# EAGLE design OneBellInterfaceRevA (EAGLE 7.2.0)
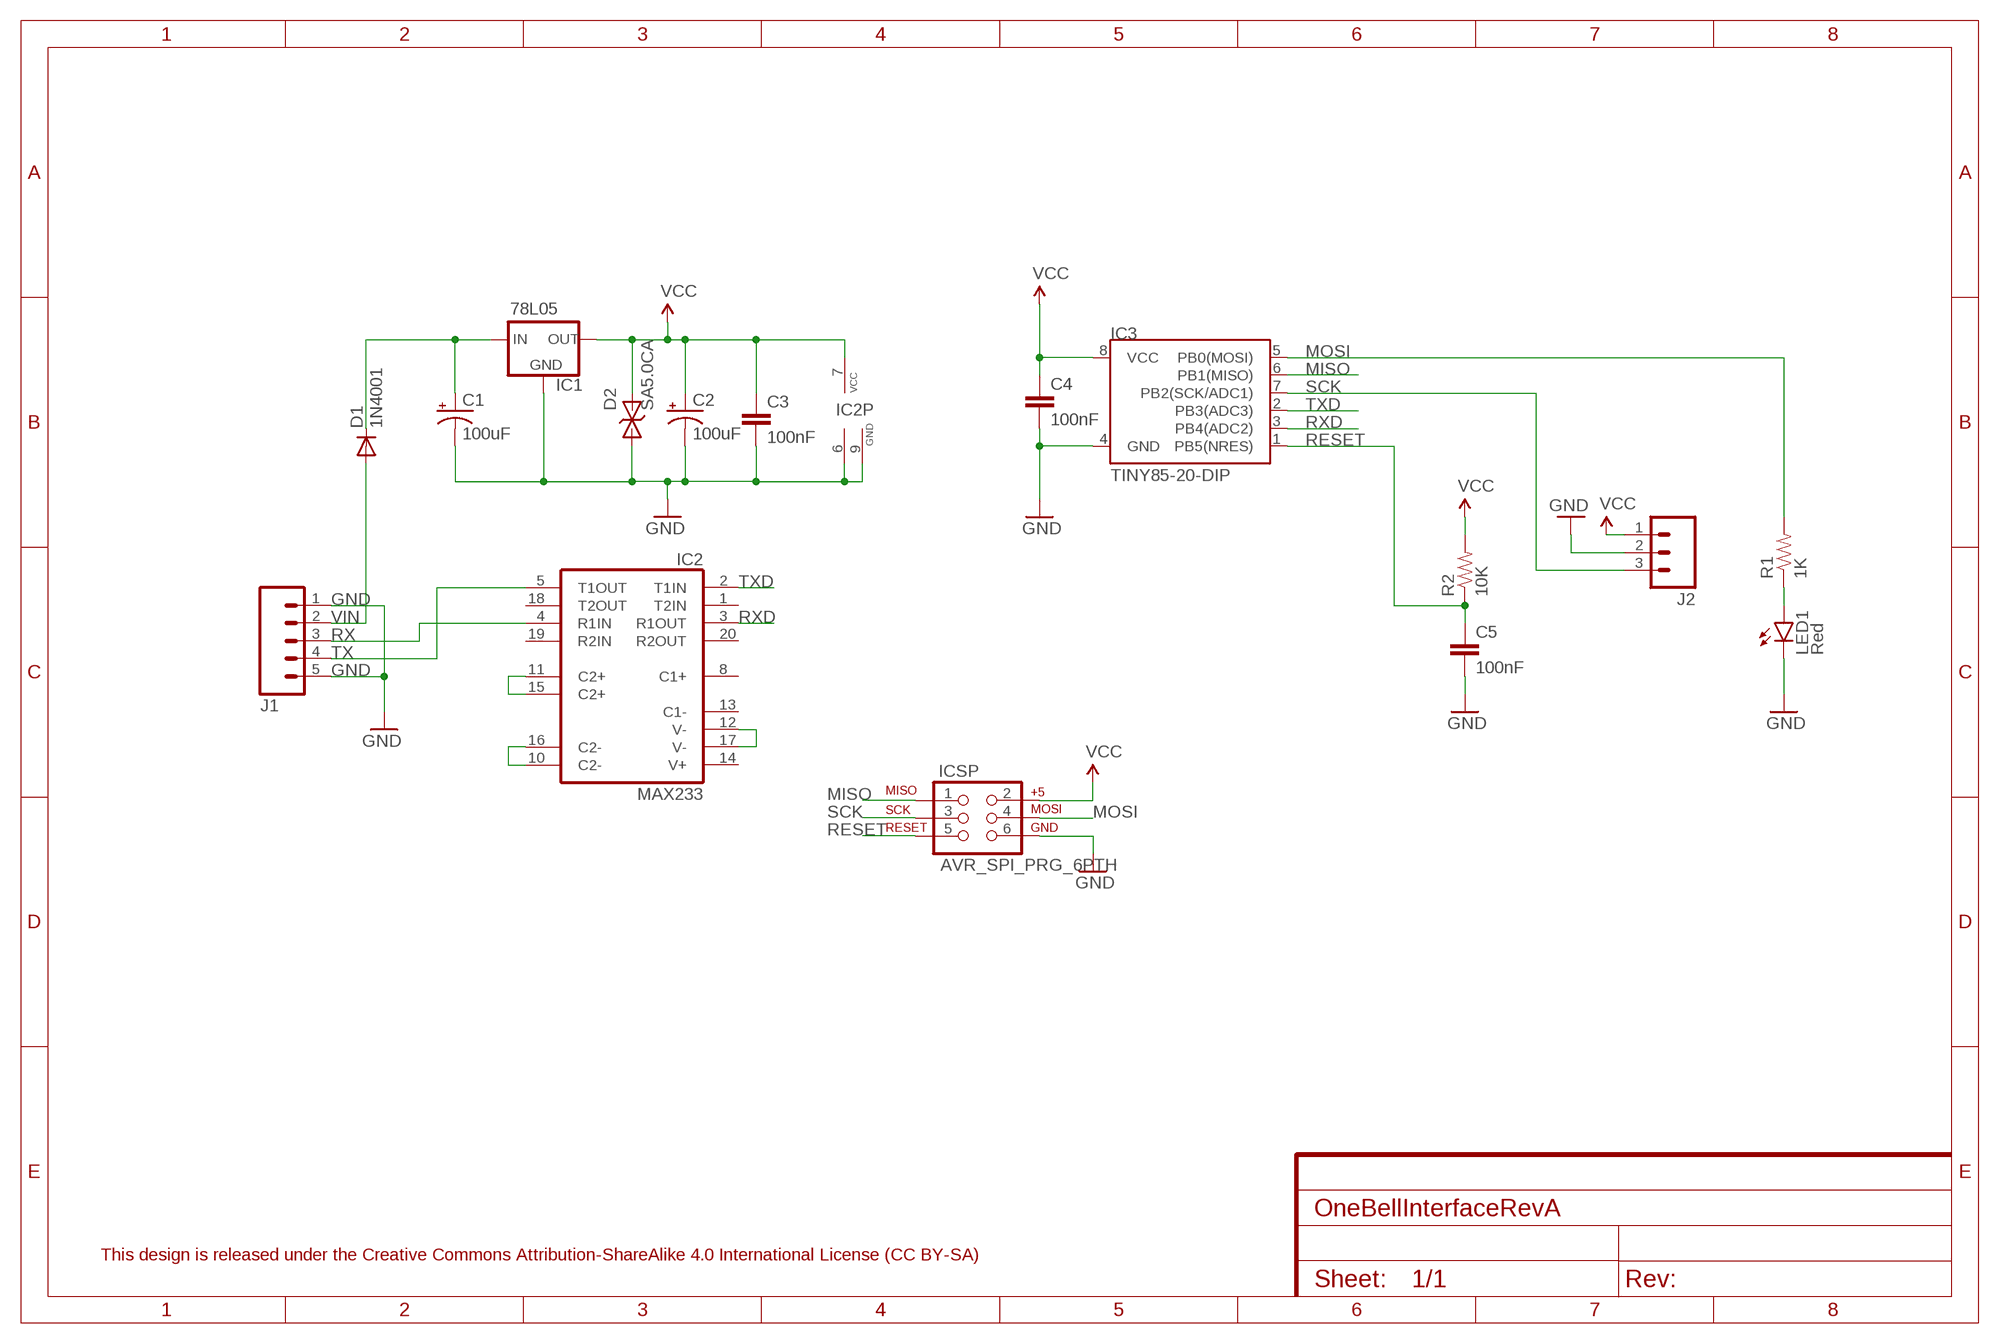
[diagram p0: schematic, sheet 1]
FRAME1 (FRAME-A4L): CNAME: One Bell Simulator Interface; CREVISION: A 05/2015; DESIGNER: Andrew Instone-Cowie

## Parts
C1  100uF  CAP_POLPTH1  [CPOL-RADIAL-100UF-25V]
C2  100uF  CAP_POLPTH1  [CPOL-RADIAL-100UF-25V]
C3  100nF  CAPPTH  [CAP-PTH-SMALL]
C4  100nF  CAPPTH  [CAP-PTH-SMALL]
C5  100nF  CAPPTH  [CAP-PTH-SMALL]
D1  1N4001  [DO41_DIODE]
D2  SA5.0CA  [DO41_TVS]
IC1  78L05  V_REG_78XXTO-92_UNTESTED  [TO-92]
IC2  MAX233  [DIL20]
IC3  TINY85-20-DIP  ATTINY45DIL08_LONG_PADS  [DIL08]
ICSP  AVR_SPI_PRG_6PTH  [2X3]
J1  M05PTH  [1X05]
J2  M03PTH  [1X03]
LED1  Red  LED3MM  [LED3MM]
R1  1K  RESISTORPTH-1/4W  [AXIAL-0.4]
R2  10K  RESISTORPTH-1/4W  [AXIAL-0.4]

## Nets
GND: C1.2(-) C2.2(-) C3.2 C4.2 C5.2 D2.A IC1.2(GND) IC2.6(GND) IC2.9(GND) IC3.4(GND) ICSP.6 J1.1 J1.5 J2.2 LED1.K(C)
MISO: IC3.6(PB1(MISO)) ICSP.1
MOSI: IC3.5(PB0(MOSI)) ICSP.4 R1.P$2
N$1: C1.1(+) D1.C IC1.3(IN)
N$6: LED1.A R1.P$1
N$10: IC2.11(C2+) IC2.15(C2+)
N$11: IC2.10(C2-) IC2.16(C2-)
N$12: IC2.12(V-) IC2.17(V-)
RESET: C5.1 IC3.1(PB5(NRES)) ICSP.5 R2.P$1
RX: IC2.4(R1IN) J1.3
RXD: IC2.3(R1OUT) IC3.3(PB4(ADC2))
SCK: IC3.7(PB2(SCK/ADC1)) ICSP.3 J2.3
TX: IC2.5(T1OUT) J1.4
TXD: IC2.2(T1IN) IC3.2(PB3(ADC3))
VCC: C2.1(+) C3.1 C4.1 D2.C IC1.1(OUT) IC2.7(VCC) IC3.8(VCC) ICSP.2 J2.1 R2.P$2
VIN: D1.A J1.2
Unconnected: IC2.1(T2IN) IC2.8(C1+) IC2.13(C1-) IC2.14(V+) IC2.18(T2OUT) IC2.19(R2IN) IC2.20(R2OUT)

## Notes on the sheet
- This design is released under the Creative Commons Attribution-ShareAlike 4.0 International License (CC BY-SA)

## Library data of the parts
C1 C2 = SparkFun-Passives:CAP_POL: Capacitor Polarized These are standard SMD and PTH capacitors. Normally 10uF, 47uF, and 100uF in electrolytic and tantalum varieties. Always verify the external diameter of the through hole cap, it varies with capacity, voltage, and manufacturer. The EIA devices should be standard.
C3-C5 = SparkFun-Passives:CAP: Capacitor Standard 0603 ceramic capacitor, and 0.1" leaded capacitor.
D1 = AIC_Custom:1N4001: DIODE general purpose rectifier, 1 A
D2 = AIC_Custom:SA5.0CA: SA5.0CA TVS Bi-Directional Transient Voltage Suppressor. 5V, DO41 package
IC1 = SparkFun-PowerIC:V_REG_78XX: Voltage Regulator Standard 78xx regulator. IGO (Input Ground Output). Spark Fun Electronics SKU : COM-00107
IC2 = maxim:MAX233: RS232 TRANSCEIVER; MPN: MAX233ACPP+G36; OC_FARNELL: 1593332; OC_NEWARK: 89K3459
IC3 = AIC_Custom:ATTINY45: Atmel 8-pin 2/4/8kB flash uC
ICSP = SparkFun-Connectors:AVR_SPI_PRG_6: AVR ISP 6 Pin This is the reduced ISP connector for AVR programming. Common on Arduino. This footprint will take up less PCB space and can be used with a 10-pin to 6-pin adapter such as SKU: BOB-08508 **Special note about "TEST_POINT" package. The stop mask is on the top side, so if you want your programming test points to be on the bottom of your board, make sure to place this package on the bottom side of the board. This also ensure that the orientation to program from the bottom side will be correct.
J1 = SparkFun-Connectors:M05: Header 5 Standard 5-pin 0.1" header. Use with straight break away headers (SKU : PRT-00116), right angle break away headers (PRT-00553), swiss pins (PRT-00743), machine pins (PRT-00117), and female headers (PRT-00115). Molex polarized connector foot print use with SKU : PRT-08230 with associated crimp pins and housings.
J2 = SparkFun-Connectors:M03: Header 3 Standard 3-pin 0.1" header. Use with straight break away headers (SKU : PRT-00116), right angle break away headers (PRT-00553), swiss pins (PRT-00743), machine pins (PRT-00117), and female headers (PRT-00115). Molex polarized connector foot print use with SKU : PRT-08232 with associated crimp pins and housings.
LED1 = SparkFun-LED:LED: LEDs Standard schematic elements and footprints for 5mm, 3mm, 1206, and 0603 sized LEDs. 5mm - Spark Fun Electronics SKU : COM-00529 (and others)
R1 R2 = SparkFun-Passives:RESISTOR: Resistor Basic schematic elements and footprints for 0603, 1206, and PTH resistors.

## Board
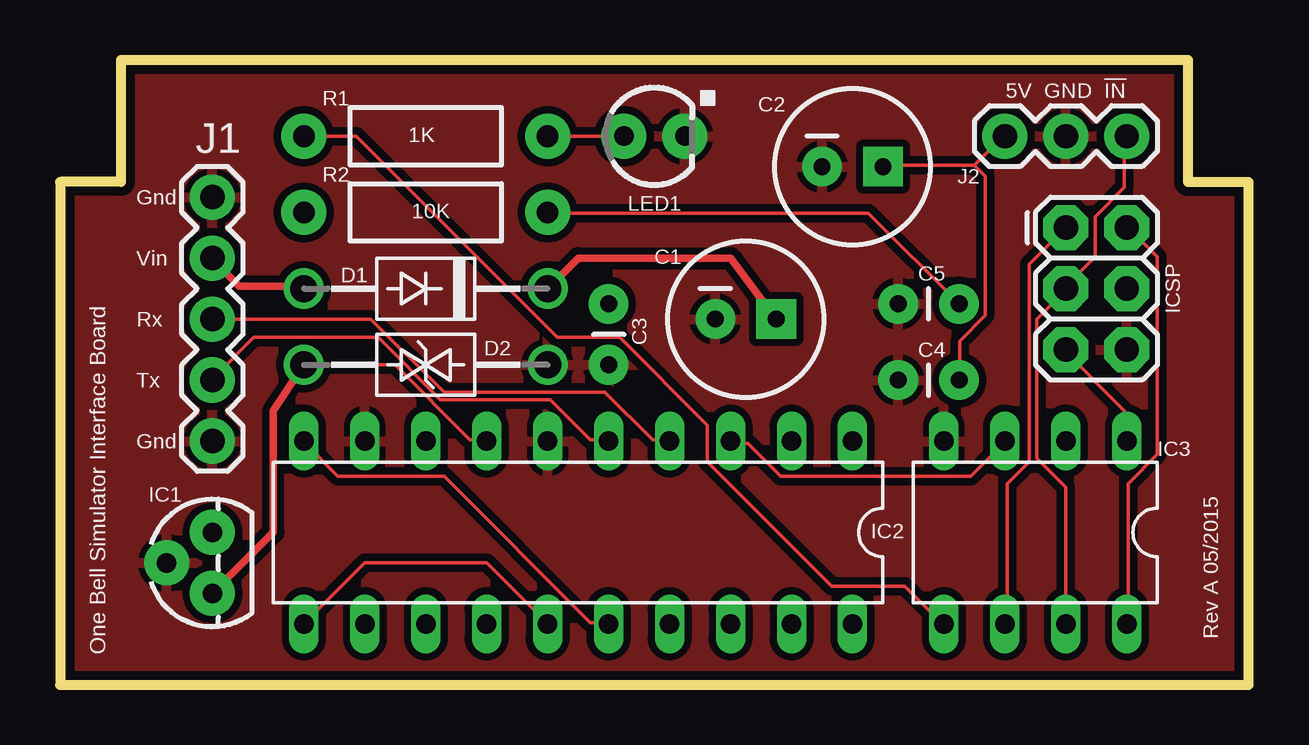
[diagram p1: board, top side]
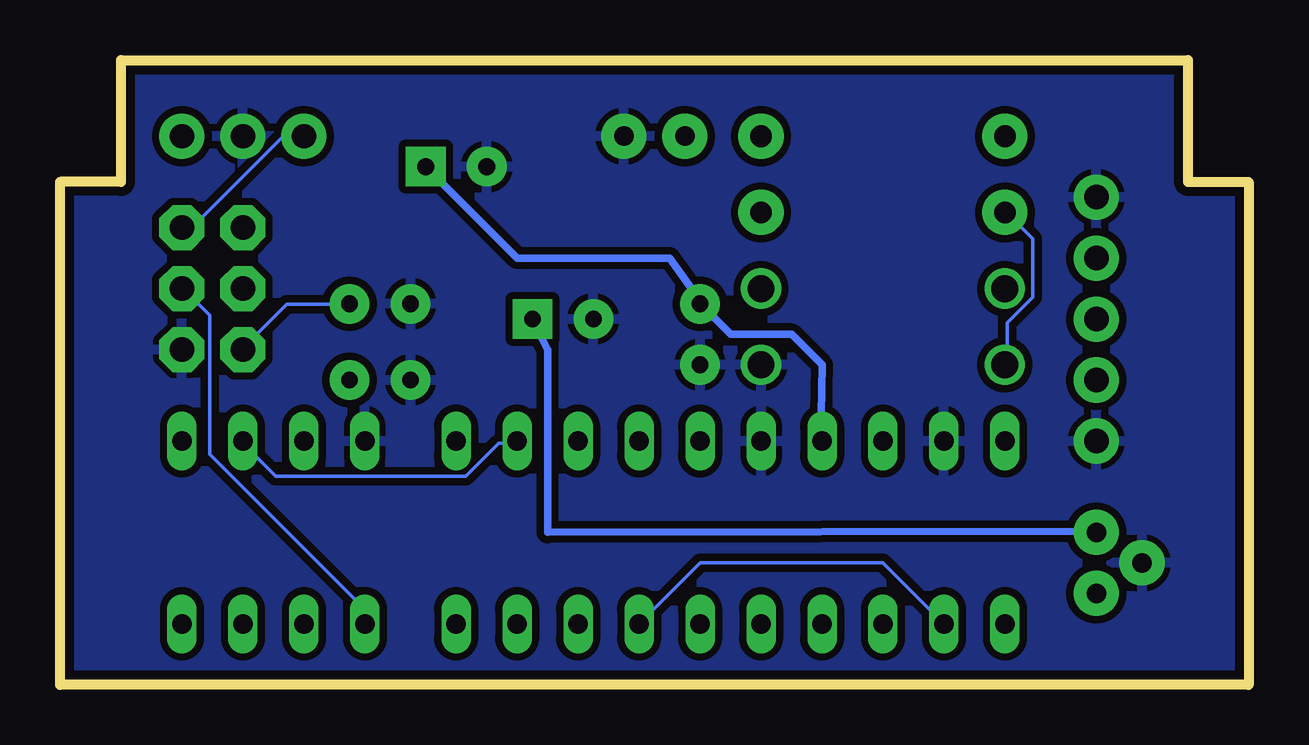
[diagram p2: board, bottom side, seen from below]

Size 49.53 x 26.04 mm. Coordinates in mm from the lower left corner, seen from the top.
Outline: 0,0 49.53,0 49.53,20.95 46.99,20.95 46.99,26.04 2.54,26.04 2.54,20.95 0,20.95 0,0
Copper layers (1*16): Top 0.0356mm / dielectric 1.5011mm / Bottom 0.0356mm
Design rules "LaenPCBOrder(OSHPARK)": minimum track width 6mil, minimum drill 13mil, track to track 6mil, track to pad 6mil, pad to pad 6mil, via to via 6mil, smd to smd 6mil, copper to edge 15mil, drill to drill 6mil, minimum pad ring 7mil, minimum via ring 7mil, stop-mask expansion 3mil, vias tented up to drill 0mil, thermal gap 10mil

### Footprints (pad centres in the part's own frame; a part is rotated, then mirrored left to right if it is on the bottom)
CPOL-RADIAL-100UF-25V = drill 0.7 pad 1.651 square: 1 1.27,0 | drill 0.7 pad 1.651: 2 -1.27,0
CAP-PTH-SMALL = drill 0.7 pad 1.651: 1 0,0; 2 2.54,0
DO41_DIODE = drill 1.118: A 5.08,0; C -5.08,0
DO41_TVS = drill 1.118: A 5.08,0; C -5.08,0
TO-92 = drill 0.813 pad 1.88: 1 -1.27,0; 2 0,1.905; 3 1.27,0
DIL20 = drill 0.813 long: 1 -11.43,-3.81; 2 -8.89,-3.81; 3 -6.35,-3.81; 4 -3.81,-3.81; 5 -1.27,-3.81; 6 1.27,-3.81; 7 3.81,-3.81; 8 6.35,-3.81; 9 8.89,-3.81; 10 11.43,-3.81; 11 11.43,3.81; 12 8.89,3.81; 13 6.35,3.81; 14 3.81,3.81; 15 1.27,3.81; 16 -1.27,3.81; 17 -3.81,3.81; 18 -6.35,3.81; 19 -8.89,3.81; 20 -11.43,3.81
DIL08 = drill 0.813 long: 1 -3.81,-3.81; 2 -1.27,-3.81; 3 1.27,-3.81; 4 3.81,-3.81; 5 3.81,3.81; 6 1.27,3.81; 7 -1.27,3.81; 8 -3.81,3.81
2X3 = drill 1.016 pad 1.88 octagon: 1 0,0; 2 0,2.54; 3 2.54,0; 4 2.54,2.54; 5 5.08,0; 6 5.08,2.54
1X05 = drill 1.016 pad 1.88: 1 0,0; 2 2.54,0; 3 5.08,0; 4 7.62,0; 5 10.16,0
1X03 = drill 1.016 pad 1.88: 1 0,0; 2 2.54,0; 3 5.08,0
LED3MM = drill 0.813 pad 1.88: A -1.27,0; K 1.27,0
AXIAL-0.4 = drill 0.9 pad 1.88: P$1 -5.08,0; P$2 5.08,0

### Placement (x,y rotation side)
C1  28.57,15.24 0 top
C2  33.02,21.59 0 top
C3  22.86,15.88 270 top
C4  37.47,12.7 180 top
C5  37.47,15.88 180 top
D1  15.24,16.51 180 top
D2  15.24,13.34 0 top
IC1  6.35,5.08 90 top
IC2  21.59,6.35 180 top
IC3  40.64,6.35 180 top
ICSP  41.91,19.05 270 top
J1  6.35,20.32 270 top
J2  39.37,22.86 0 top
LED1  24.77,22.86 0 top
R1  15.24,22.86 180 top
R2  15.24,19.68 180 top

### Tracks (layer width: path | path; a pad name or v marks a point on that pad's centre or on a via)
GND
  pour Bottom (isolate 0.305): 2.54,26.04 2.54,20.95 0,20.95 0,0 49.53,0 49.53,20.95 46.99,20.95 46.99,26.04
  pour Top (isolate 0.305): 2.54,26.04 2.54,20.95 0,20.95 0,0 49.53,0 49.53,20.95 46.99,20.95 46.99,26.04
MISO
  Top 0.152: ICSP.1 40.39,17.53 40.39,9.3 39.47,8.38 39.47,2.59 IC3.6
MOSI
  Top 0.152: R1.P$2 12.34,22.86 20.73,14.48 23.32,14.48 26.98,10.82 26.98,9.3 32.16,4.12 35.2,4.12 36.73,2.59 IC3.5
  Bottom 0.152: IC3.5 36.88,2.59 36.88,3.2 43.28,9.6 43.28,15.39 44.35,16.46 ICSP.4
N$1
  Top 0.305: D1.C 21.59,17.78 27.94,17.78 C1.1
  Bottom 0.152: 6.4,6.4 IC1.3
  Bottom 0.305: 6.4,6.4 29.21,6.35 29.21,13.97 C1.1
N$6
  Top 0.152: LED1.A R1.P$1
N$10
  Top 0.152: IC2.11 12.7,5.08 17.78,5.08 IC2.15
N$11
  Top 0.152: IC2.16 22.86,2.59 22.1,2.59 16,8.69 11.58,8.69 10.21,10.06 IC2.10
N$12
  Bottom 0.152: IC2.12 15.24,5.08 22.86,5.08 IC2.17
RESET
  Top 0.152: IC3.1 44.35,10.21 44.35,11.43 41.91,13.87 ICSP.5 | C5.1 33.68,19.66 20.42,19.66 R2.P$1
  Bottom 0.152: C5.1 37.49,15.85 40.08,15.85 41.91,14.02 ICSP.5
RX
  Top 0.152: J1.3 12.95,15.24 16,12.19 22.71,12.19 24.69,10.21 25.3,10.21 IC2.4
RXD
  Top 0.152: IC2.3 28.04,10.06 28.65,10.06 30.02,8.69 37.95,8.69 39.32,10.06 IC3.3
SCK
  Top 0.152: IC3.7 41.91,8.23 40.69,9.45 40.69,15.24 41.91,16.46 ICSP.3 41.91,16.61 43.13,17.83 43.13,19.51 44.35,20.73 44.35,22.86 J2.3
TX
  Top 0.152: IC2.5 22.86,10.21 22.1,10.21 20.42,11.89 15.85,11.89 13.26,14.48 8.08,14.48 6.4,12.8 J1.4
TXD
  Bottom 0.152: IC2.2 30.48,10.06 31.24,10.06 32.61,8.69 40.54,8.69 41.91,10.06 IC3.2
VCC
  Top 0.152: 38.1,21.64 34.29,21.64 C2.1 | 38.1,21.64 39.32,22.86 J2.1 | 38.1,21.64 38.56,21.18 38.56,15.39 37.49,14.33 37.49,12.8 C4.1 | IC3.8 44.5,2.59 44.5,8.38 45.72,9.6 45.72,17.83 44.5,19.05 ICSP.2 | IC2.7 17.68,10.21 17.07,10.21 13.97,13.34 D2.C
  Top 0.305: IC1.1 8.89,6.35 8.89,11.43 D2.C
  Bottom 0.152: J2.1 40.23,22.86 44.04,19.05 ICSP.2 | 17.83,10.21 IC2.7 | 22.86,15.85 C3.1 22.86,16 | D2.C 10.06,13.41 10.06,15.09 8.99,16.15 8.99,18.59 10.06,19.66 R2.P$2 | 34.29,21.49 C2.1
  Bottom 0.305: 17.83,10.21 17.78,13.34 19.05,14.61 21.59,14.61 C3.1 | 22.86,16 24.13,17.78 30.48,17.78 C2.1
VIN
  Top 0.305: D1.A 10.06,16.61 7.47,16.61 6.4,17.68 J1.2

### Text on the board
tPlace: 5V GND !IN! | Gnd / / Vin / / Rx / / Tx / / Gnd | Rev A 05/2015 | One Bell Simulator Interface Board